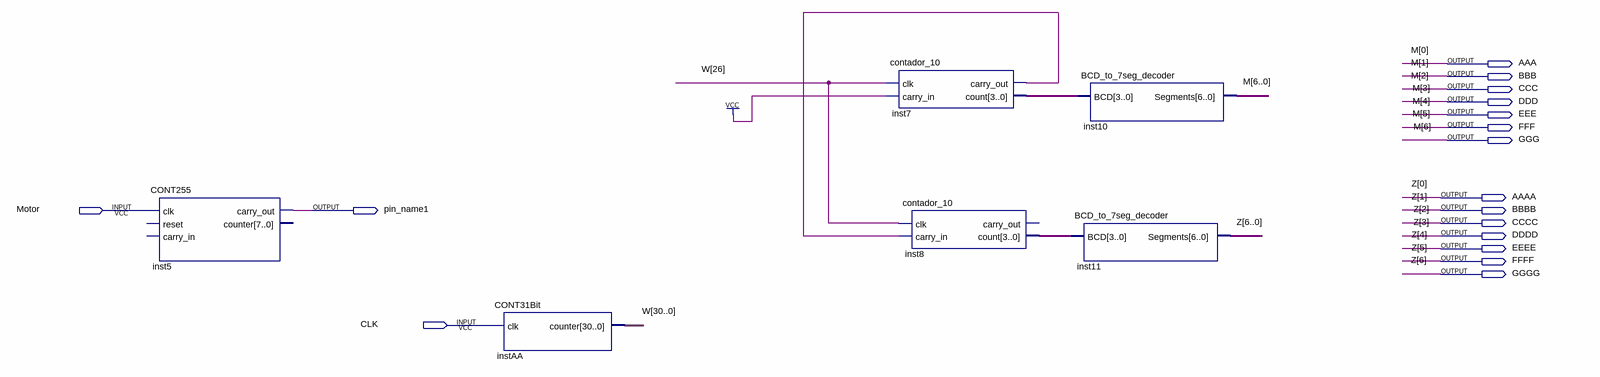
[diagram p0: schematic sheet]
// Quartus schematic CONT_DISP.bdf as structural Verilog: 6 symbols, 17 pins
module CONT_DISP (
  input  Motor,
  input  CLK,
  output AAA,
  output BBB,
  output CCC,
  output DDD,
  output EEE,
  output FFF,
  output GGG,
  output AAAA,
  output pin_name1,
  output BBBB,
  output CCCC,
  output DDDD,
  output EEEE,
  output FFFF,
  output GGGG
);

  wire inst7_carry_out;
  wire [3:0] inst7_count, inst8_count;
  wire [30:0] W;

  CONT255 inst5 (.clk(Motor), .carry_out(pin_name1));  // open: reset, carry_in, counter
  CONT31Bit instAA (.clk(CLK), .counter(W));
  contador_10 inst7 (.clk(W[26]), .carry_in(1'b1), .carry_out(inst7_carry_out), .count(inst7_count));
  contador_10 inst8 (.clk(W[26]), .carry_in(inst7_carry_out), .count(inst8_count));  // open: carry_out
  BCD_to_7seg_decoder inst10 (.BCD(inst7_count), .Segments({GGG, FFF, EEE, DDD, CCC, BBB, AAA}));
  BCD_to_7seg_decoder inst11 (.BCD(inst8_count), .Segments({GGGG, FFFF, EEEE, DDDD, CCCC, BBBB, AAAA}));

  // Other names for the same wires on the sheet: M[6:0] = {GGG, FFF, EEE, DDD, CCC, BBB, AAA};
  //   Z[6:0] = {GGGG, FFFF, EEEE, DDDD, CCCC, BBBB, AAAA}
endmodule
